# Altium project BMS_AFE.PrjPcb (part 3 of 3)
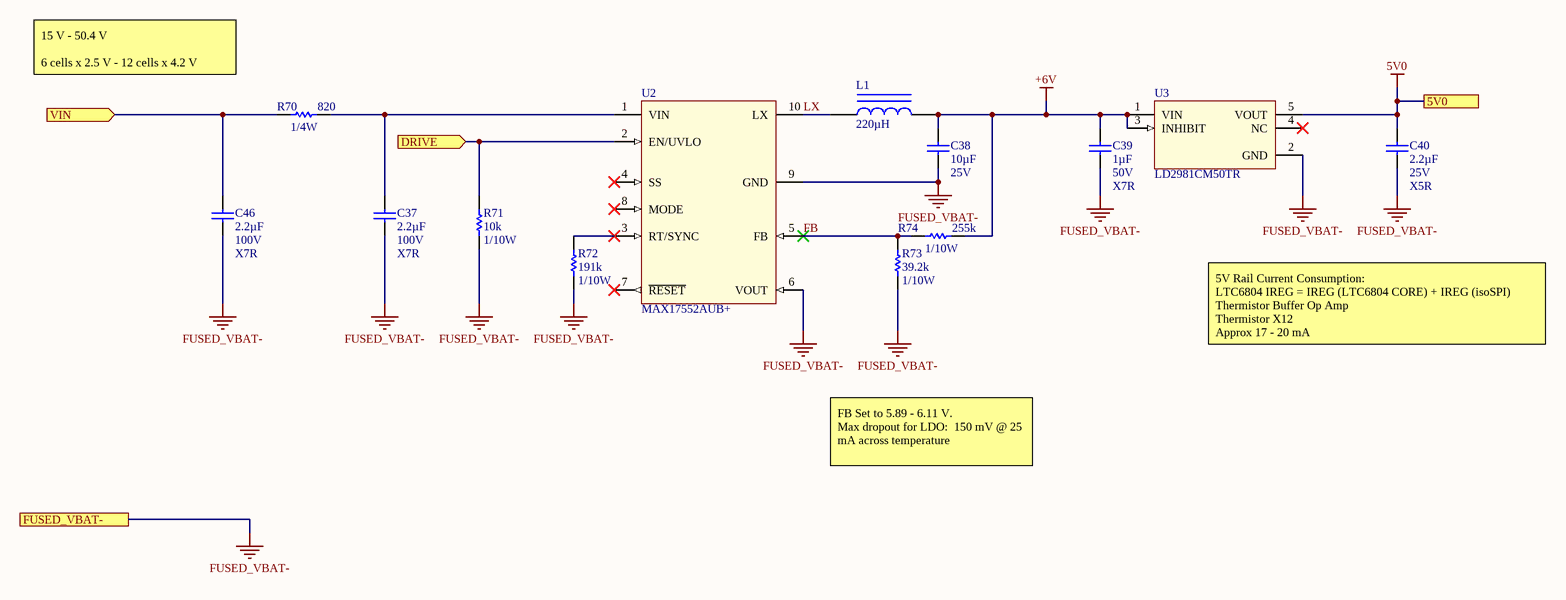
[diagram p8: BMS AFE - Regulator.SchDoc]

## Nets that join several sheets
3V0_VREF2: BMS AFE - AFE (R80.2 U6.1 U6.4), BMS AFE - Thermistors (16 pins)
5V0: BMS AFE - AFE (12 pins), BMS AFE - Thermistors (5 pins), BMS AFE - Regulator (C40.1 U3.5)
FUSED_VBAT+: BMS AFE - AFE (R5.1 R7.1), BMS AFE - Cell Inputs (F2.2), BMS AFE - Regulator (C46.1 R70.1)
FUSED_VBAT-: BMS AFE - AFE (12 pins), BMS AFE - Cell Inputs (14 pins), BMS AFE - Communications (C18.2 C19.2 C20.2 C21.2), BMS AFE - Thermistors (8 pins), BMS AFE - Connectors (31 pins), BMS AFE - Regulator (11 pins)
AFE_BALANCE_CONTROL_1: BMS AFE - AFE (U1.25), BMS AFE - Cell Balancing (R50.1)
AFE_BALANCE_CONTROL_2: BMS AFE - AFE (U1.23), BMS AFE - Cell Balancing (R49.1)
AFE_BALANCE_CONTROL_3: BMS AFE - AFE (U1.21), BMS AFE - Cell Balancing (R48.1)
AFE_BALANCE_CONTROL_4: BMS AFE - AFE (U1.19), BMS AFE - Cell Balancing (R47.1)
AFE_BALANCE_CONTROL_5: BMS AFE - AFE (U1.17), BMS AFE - Cell Balancing (R46.1)
AFE_BALANCE_CONTROL_6: BMS AFE - AFE (U1.15), BMS AFE - Cell Balancing (R45.1)
AFE_BALANCE_CONTROL_7: BMS AFE - AFE (U1.13), BMS AFE - Cell Balancing (R32.1)
AFE_BALANCE_CONTROL_8: BMS AFE - AFE (U1.11), BMS AFE - Cell Balancing (R31.1)
AFE_BALANCE_CONTROL_9: BMS AFE - AFE (U1.9), BMS AFE - Cell Balancing (R30.1)
AFE_BALANCE_CONTROL_10: BMS AFE - AFE (U1.7), BMS AFE - Cell Balancing (R29.1)
AFE_BALANCE_CONTROL_11: BMS AFE - AFE (U1.5), BMS AFE - Cell Balancing (R28.1)
AFE_BALANCE_CONTROL_12: BMS AFE - AFE (U1.3), BMS AFE - Cell Balancing (R27.1)
AFE_CELL_INPUT_0: BMS AFE - AFE (U1.26), BMS AFE - Cell Inputs (C17.1 D12.2 R65.2)
AFE_CELL_INPUT_1: BMS AFE - AFE (U1.24), BMS AFE - Cell Inputs (C16.1 D11.2 D12.1 R64.2)
AFE_CELL_INPUT_2: BMS AFE - AFE (U1.22), BMS AFE - Cell Inputs (C15.1 D10.2 D11.1 R63.2)
AFE_CELL_INPUT_3: BMS AFE - AFE (U1.20), BMS AFE - Cell Inputs (C14.1 D9.2 D10.1 R62.2)
AFE_CELL_INPUT_4: BMS AFE - AFE (U1.18), BMS AFE - Cell Inputs (C13.1 D8.2 D9.1 R61.2)
AFE_CELL_INPUT_5: BMS AFE - AFE (U1.16), BMS AFE - Cell Inputs (C12.1 D7.2 D8.1 R60.2)
AFE_CELL_INPUT_6: BMS AFE - AFE (U1.14), BMS AFE - Cell Inputs (C11.1 D6.2 D7.1 R59.2)
AFE_CELL_INPUT_7: BMS AFE - AFE (U1.12), BMS AFE - Cell Inputs (C10.1 D5.2 D6.1 R58.2)
AFE_CELL_INPUT_8: BMS AFE - AFE (U1.10), BMS AFE - Cell Inputs (C9.1 D4.2 D5.1 R57.2)
AFE_CELL_INPUT_9: BMS AFE - AFE (U1.8), BMS AFE - Cell Inputs (C8.1 D3.2 D4.1 R56.2)
AFE_CELL_INPUT_10: BMS AFE - AFE (U1.6), BMS AFE - Cell Inputs (C7.1 D2.2 D3.1 R55.2)
AFE_CELL_INPUT_11: BMS AFE - AFE (U1.4), BMS AFE - Cell Inputs (C6.1 D1.2 D2.1 R54.2)
AFE_CELL_INPUT_12: BMS AFE - AFE (U1.2), BMS AFE - Cell Inputs (C5.1 D1.1 R53.2)
AFE_TEMP_MUX_SELECT_0: BMS AFE - AFE (R4.1 U1.28), BMS AFE - Thermistors (U5.10)
AFE_TEMP_MUX_SELECT_1: BMS AFE - AFE (R3.1 U1.29), BMS AFE - Thermistors (U5.11)
AFE_TEMP_MUX_SELECT_2: BMS AFE - AFE (R2.1 U1.32), BMS AFE - Thermistors (U5.14)
AFE_TEMP_MUX_SELECT_3: BMS AFE - AFE (R1.1 U1.33), BMS AFE - Thermistors (U5.13)
CELL_INPUT_0: BMS AFE - Cell Inputs (F15.1 R52.1), BMS AFE - Connectors (P2.4)
CELL_INPUT_1: BMS AFE - Cell Inputs (F14.1), BMS AFE - Connectors (P2.9)
CELL_INPUT_2: BMS AFE - Cell Inputs (F13.1), BMS AFE - Connectors (P2.8)
CELL_INPUT_3: BMS AFE - Cell Inputs (F12.1), BMS AFE - Connectors (P2.3)
CELL_INPUT_4: BMS AFE - Cell Inputs (F11.1), BMS AFE - Connectors (P2.2)
CELL_INPUT_5: BMS AFE - Cell Inputs (F10.1), BMS AFE - Connectors (P2.7)
CELL_INPUT_6: BMS AFE - Cell Inputs (F9.1), BMS AFE - Connectors (P2.1)
CELL_INPUT_7: BMS AFE - Cell Inputs (F8.1), BMS AFE - Connectors (P1.4)
CELL_INPUT_8: BMS AFE - Cell Inputs (F7.1), BMS AFE - Connectors (P1.7)
CELL_INPUT_9: BMS AFE - Cell Inputs (F6.1), BMS AFE - Connectors (P1.3)
CELL_INPUT_10: BMS AFE - Cell Inputs (F5.1), BMS AFE - Connectors (P1.6)
CELL_INPUT_11: BMS AFE - Cell Inputs (F4.1), BMS AFE - Connectors (P1.2)
CELL_INPUT_12: BMS AFE - Cell Inputs (F3.1 R51.2), BMS AFE - Connectors (P1.5)
FUSED_CELL_0: BMS AFE - Cell Balancing (R38.2 R44.2), BMS AFE - Cell Inputs (F15.2 R65.1)
FUSED_CELL_1: BMS AFE - Cell Balancing (Q12.2 R37.2 R43.2), BMS AFE - Cell Inputs (F14.2 R64.1)
FUSED_CELL_2: BMS AFE - Cell Balancing (Q11.2 R36.2 R42.2), BMS AFE - Cell Inputs (F13.2 R63.1)
FUSED_CELL_3: BMS AFE - Cell Balancing (Q10.2 R35.2 R41.2), BMS AFE - Cell Inputs (F12.2 R62.1)
FUSED_CELL_4: BMS AFE - Cell Balancing (Q9.2 R34.2 R40.2), BMS AFE - Cell Inputs (F11.2 R61.1)
FUSED_CELL_5: BMS AFE - Cell Balancing (Q8.2 R33.2 R39.2), BMS AFE - Cell Inputs (F10.2 R60.1)
FUSED_CELL_6: BMS AFE - Cell Balancing (Q7.2 R20.2 R26.2), BMS AFE - Cell Inputs (F9.2 R59.1)
FUSED_CELL_7: BMS AFE - Cell Balancing (Q6.2 R19.2 R25.2), BMS AFE - Cell Inputs (F8.2 R58.1)
FUSED_CELL_8: BMS AFE - Cell Balancing (Q5.2 R18.2 R24.2), BMS AFE - Cell Inputs (F7.2 R57.1)
FUSED_CELL_9: BMS AFE - Cell Balancing (Q4.2 R17.2 R23.2), BMS AFE - Cell Inputs (F6.2 R56.1)
FUSED_CELL_10: BMS AFE - Cell Balancing (Q3.2 R16.2 R22.2), BMS AFE - Cell Inputs (F5.2 R55.1)
FUSED_CELL_11: BMS AFE - Cell Balancing (Q2.2 R15.2 R21.2), BMS AFE - Cell Inputs (F4.2 R54.1)
FUSED_CELL_12: BMS AFE - Cell Balancing (Q1.2), BMS AFE - Cell Inputs (F3.2 R53.1)
IA_N: BMS AFE - AFE (R12.1 U1.41), BMS AFE - Communications (R69.2 XFMR1.8)
IA_P: BMS AFE - AFE (R10.1 U1.42), BMS AFE - Communications (R68.1 XFMR1.6)
IB_N: BMS AFE - AFE (U1.47), BMS AFE - Communications (R67.2 XFMR1.3)
IB_P: BMS AFE - AFE (U1.48), BMS AFE - Communications (R66.1 XFMR1.1)
ISOSPI_IA_N: BMS AFE - Communications (XFMR1.9), BMS AFE - Connectors (P5.1)
ISOSPI_IA_P: BMS AFE - Communications (XFMR1.11), BMS AFE - Connectors (P5.2)
ISOSPI_IB_N: BMS AFE - Communications (XFMR1.14), BMS AFE - Connectors (P6.1)
ISOSPI_IB_P: BMS AFE - Communications (XFMR1.16), BMS AFE - Connectors (P6.2)
NetC42_1: BMS AFE - AFE (U1.27), BMS AFE - Thermistors (C42.1 R78.2)
NetF1_1: BMS AFE - Cell Inputs (F1.1 R52.2), BMS AFE - Connectors (P2.5)
NetF2_1: BMS AFE - Cell Inputs (F2.1 R51.1), BMS AFE - Connectors (P1.1)
NetP7_1: BMS AFE - AFE (R10.2), BMS AFE - Connectors (P7.1)
NetP7_2: BMS AFE - AFE (U1.43), BMS AFE - Connectors (P7.2)
NetP7_3: BMS AFE - AFE (R8.2 U1.44), BMS AFE - Connectors (P7.3)
NetP7_4: BMS AFE - AFE (R12.2), BMS AFE - Connectors (P7.4)
NetR71_1: BMS AFE - AFE (U1.38), BMS AFE - Regulator (R71.1 U2.2)
THERMISTOR_AMBIENT_0: BMS AFE - Thermistors (R79.1 U5.19), BMS AFE - Connectors (C34.1 P4.7)
THERMISTOR_AMBIENT_1: BMS AFE - Thermistors (R79.2 U5.18), BMS AFE - Connectors (C35.1 P8.1)
THERMISTOR_AMBIENT_2: BMS AFE - Thermistors (R79.3 U5.17), BMS AFE - Connectors (C36.1 P9.1)
THERMISTOR_CELL_0: BMS AFE - Thermistors (R75.1 U5.9), BMS AFE - Connectors (C33.1 P4.6)
THERMISTOR_CELL_1: BMS AFE - Thermistors (R75.2 U5.8), BMS AFE - Connectors (C31.1 P4.5)
THERMISTOR_CELL_2: BMS AFE - Thermistors (R75.3 U5.7), BMS AFE - Connectors (C29.1 P4.4)
THERMISTOR_CELL_3: BMS AFE - Thermistors (R75.4 U5.6), BMS AFE - Connectors (C27.1 P4.3)
THERMISTOR_CELL_4: BMS AFE - Thermistors (R76.1 U5.5), BMS AFE - Connectors (C25.1 P4.2)
THERMISTOR_CELL_5: BMS AFE - Thermistors (R76.2 U5.4), BMS AFE - Connectors (C23.1 P4.1)
THERMISTOR_CELL_6: BMS AFE - Thermistors (R76.3 U5.3), BMS AFE - Connectors (C32.1 P3.6)
THERMISTOR_CELL_7: BMS AFE - Thermistors (R76.4 U5.2), BMS AFE - Connectors (C30.1 P3.5)
THERMISTOR_CELL_8: BMS AFE - Thermistors (R77.1 U5.23), BMS AFE - Connectors (C28.1 P3.4)
THERMISTOR_CELL_9: BMS AFE - Thermistors (R77.2 U5.22), BMS AFE - Connectors (C26.1 P3.3)
THERMISTOR_CELL_10: BMS AFE - Thermistors (R77.3 U5.21), BMS AFE - Connectors (C24.1 P3.2)
THERMISTOR_CELL_11: BMS AFE - Thermistors (R77.4 U5.20), BMS AFE - Connectors (C22.1 P3.1)

## Assembly variants
01 - Standard: not fitted P5 R2 R9 R10 R11 R51 R65 R80